# EAGLE design base (EAGLE 6.5.0)
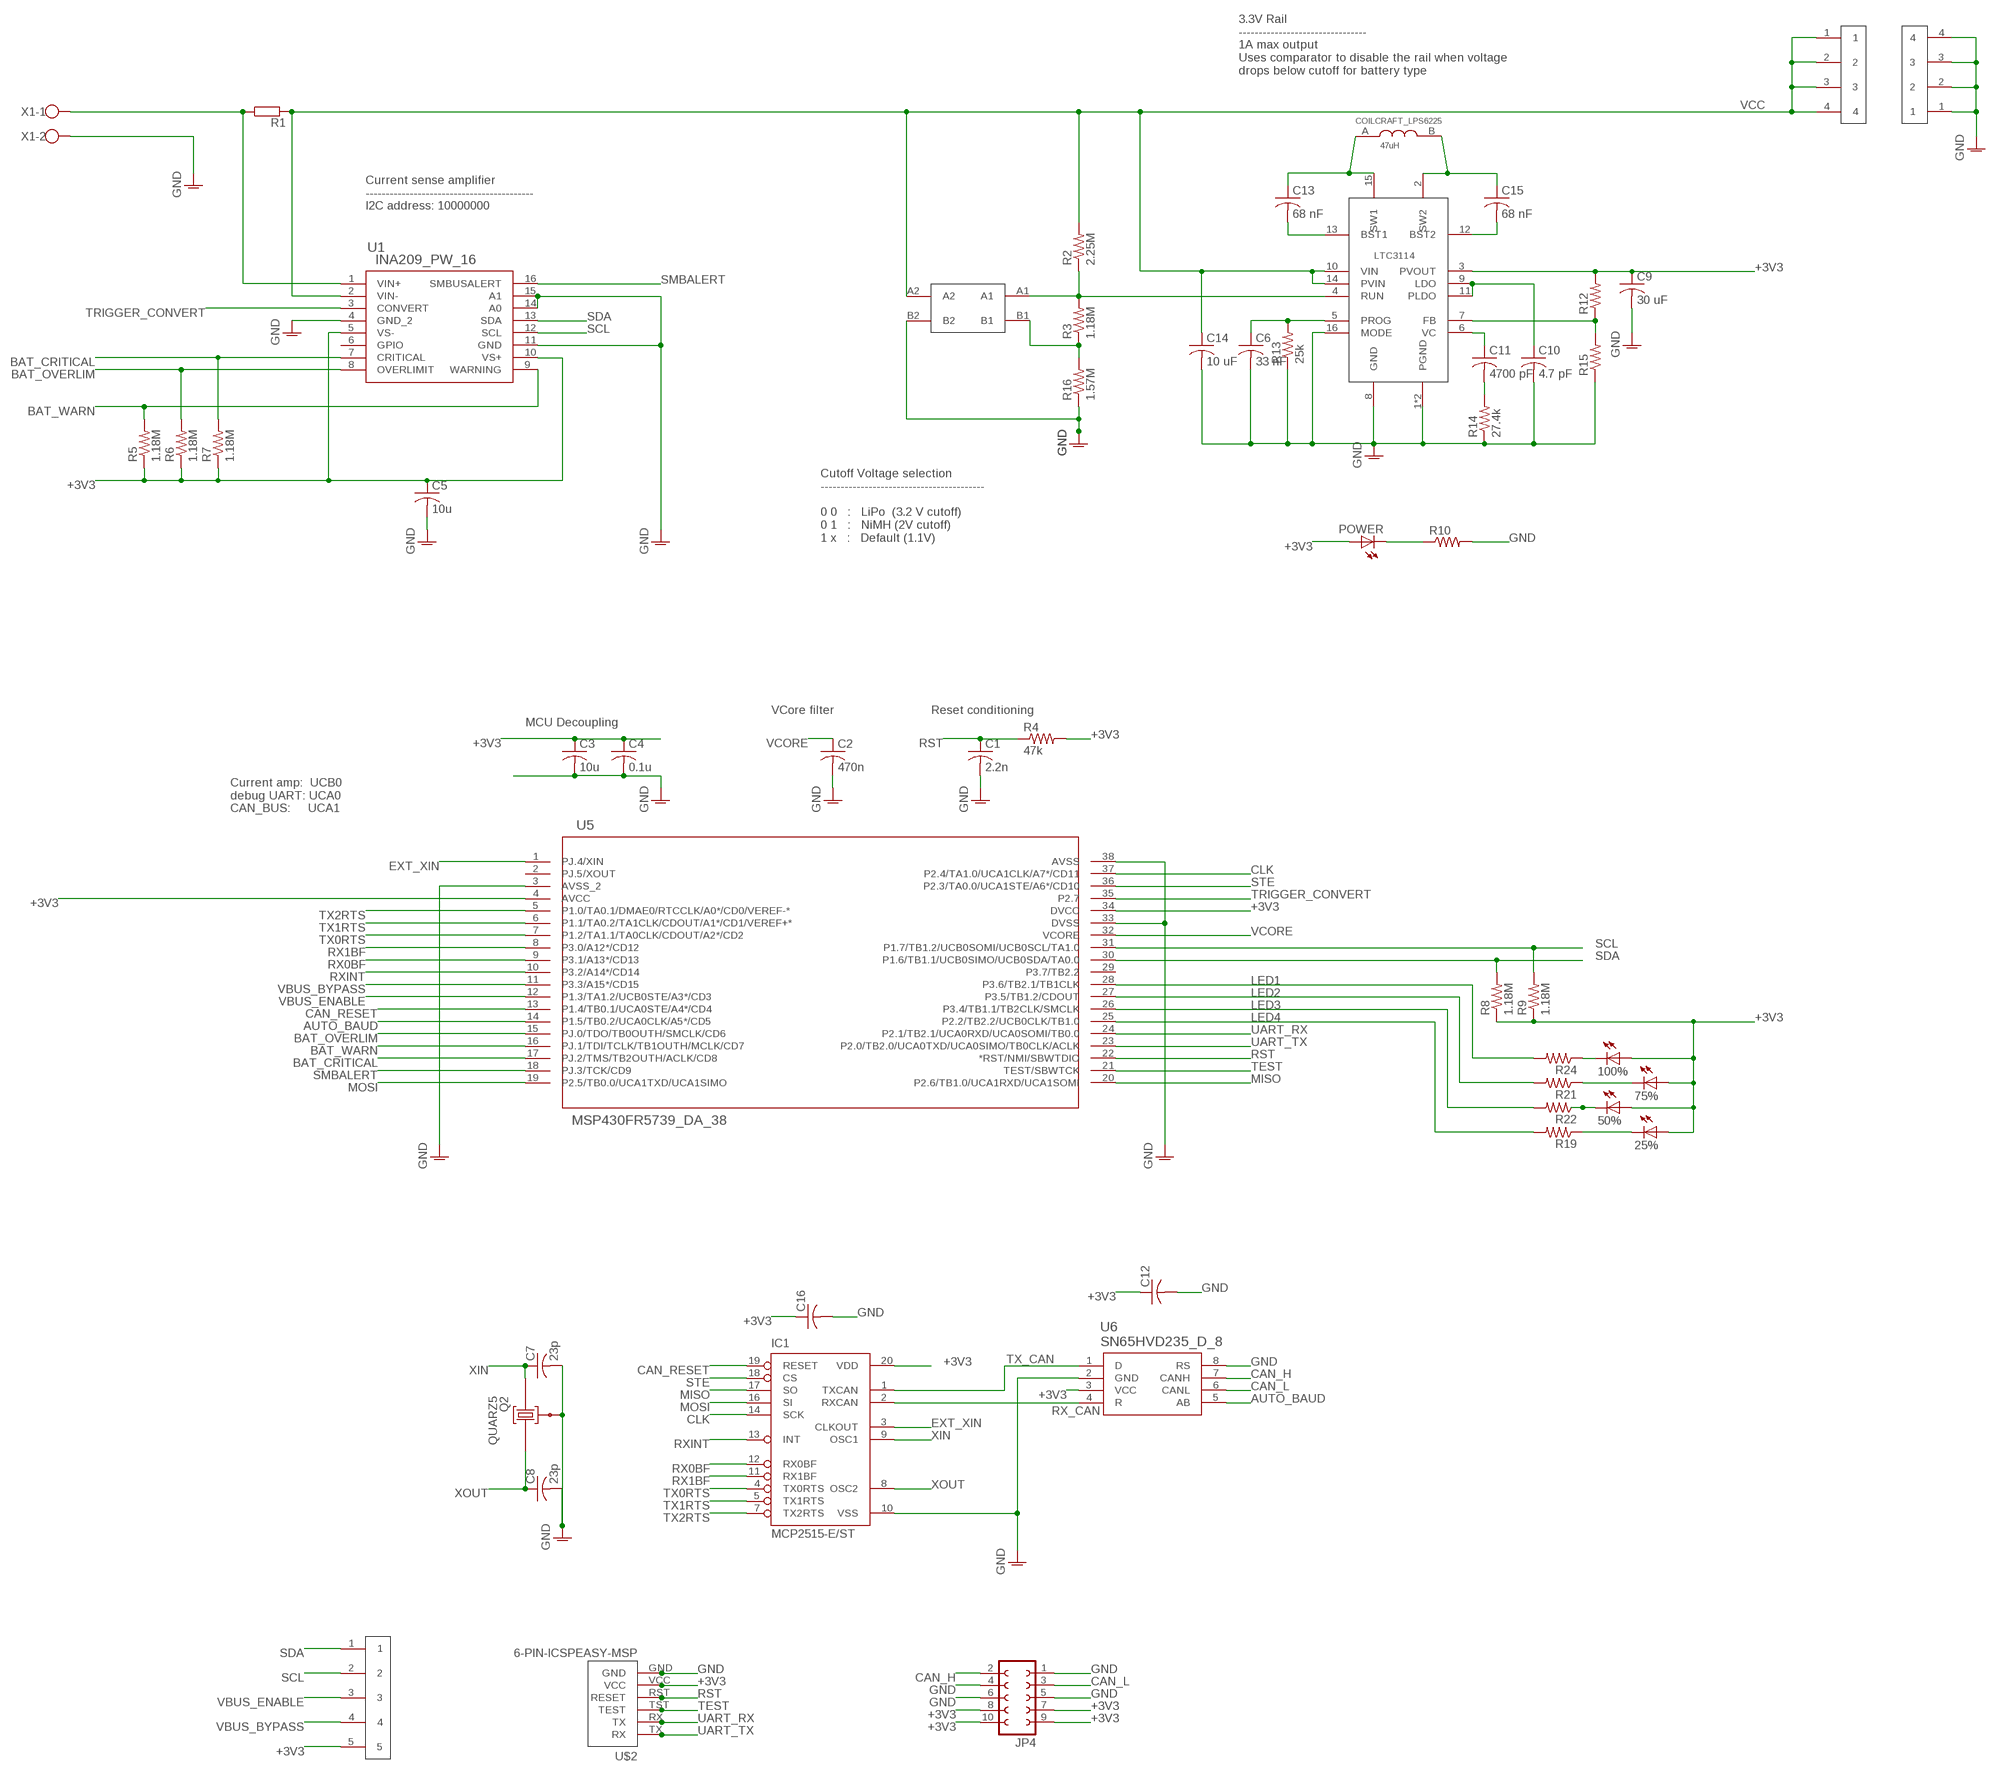
[diagram p0: schematic, sheet 1]

## Parts
25%  LEDCHIP-LED0603  [CHIP-LED0603]
50%  LEDCHIP-LED0603  [CHIP-LED0603]
75%  LEDCHIP-LED0603  [CHIP-LED0603]
100%  LEDCHIP-LED0603  [CHIP-LED0603]
C1  2.2n  C-USC1206  [C1206]
C2  470n  C-USC1206  [C1206]
C3  10u  C-USC1206  [C1206]
C4  0.1u  C-USC1206  [C1206]
C5  10u  C-USC1206  [C1206]
C6  33 nF  C-USC0805  [C0805]
C7  23p  C-USC1206  [C1206]
C8  23p  C-USC1206  [C1206]
C9  30 uF  C-USC0805  [C0805]
C10  4.7 pF  C-USC0805  [C0805]
C11  4700 pF  C-USC0805  [C0805]
C12  C-USC0603  [C0603]
C13  68 nF  C-USC0805  [C0805]
C14  10 uF  C-USC0805  [C0805]
C15  68 nF  C-USC0805  [C0805]
C16  C-USC0603  [C0603]
COILCRAFT_LPS6225  47uH  COILCRAFT_LPS6225  [INDUCTOR]
IC1  MCP2515-E/ST  [TSSOP20]
JP4  FE05-2  [FE05-2]
POWER  LEDCHIP-LED0603  [CHIP-LED0603]
Q2  QUARZ5  [QUARZ5]
R1  SMR  [SMR]
R2  2.25M  R-US_R0805  [R0805]
R3  1.18M  R-US_R0805  [R0805]
R4  47k  R-US_R1206  [R1206]
R5  1.18M  R-US_R0805  [R0805]
R6  1.18M  R-US_R0805  [R0805]
R7  1.18M  R-US_R0805  [R0805]
R8  1.18M  R-US_R0805  [R0805]
R9  1.18M  R-US_R0805  [R0805]
R10  R-US_R0603  [R0603]
R12  R-US_M0805  [M0805]
R13  25k  R-US_M0805  [M0805]
R14  27.4k  R-US_M0805  [M0805]
R15  R-US_M0805  [M0805]
R16  1.57M  R-US_R0805  [R0805]
R19  R-US_R0603  [R0603]
R21  R-US_R0603  [R0603]
R22  R-US_R0603  [R0603]
R24  R-US_R0603  [R0603]
U1  INA209_PW_16  [PW16]
U5  MSP430FR5739_DA_38  [DA38]
U6  SN65HVD235_D_8  [D8]
U$1  LTC3114  [TSSOP-16]
U$2  6-PIN-ICSPEASY-MSP  [EASYMSP-6PIN]
U$3  1X4_HEADER  [1X4-.1HEADER]
U$4  1X5_HEADER  [1X5-.1HEADER]
U$5  76SB02T  [DIP-4]
U$11  1X4_HEADER  [1X4-.1HEADER]
X1  W237-102  [W237-102]

## Nets
+3V3: 25%.A 50%.A 75%.A 100%.A C3.1 C4.1 C5.1 C9.1 C12.1 C16.1 IC1.20(VDD) JP4.7 JP4.8 JP4.9 JP4.10 POWER.A R4.2 R5.1 R6.1 R7.1 R8.1 R9.1 R12.2 U1.5(VS-) U1.10(VS+) U5.4(AVCC) U5.34(DVCC) U6.3(VCC) U$1.3(PVOUT) U$2.VCC U$4.5
AUTO_BAUD: U5.14(P1.5/TB0.2/UCA0CLK/A5*/CD5) U6.5(AB)
BAT_CRITICAL: R7.2 U1.7(CRITICAL) U5.17(PJ.2/TMS/TB2OUTH/ACLK/CD8)
BAT_OVERLIM: R6.2 U1.8(OVERLIMIT) U5.15(PJ.0/TDO/TB0OUTH/SMCLK/CD6)
BAT_WARN: R5.2 U1.9(WARNING) U5.16(PJ.1/TDI/TCLK/TB1OUTH/MCLK/CD7)
CAN_H: JP4.2 U6.7(CANH)
CAN_L: JP4.3 U6.6(CANL)
CAN_RESET: IC1.19(RESET) U5.13(P1.4/TB0.1/UCA0STE/A4*/CD4)
CLK: IC1.14(SCK) U5.37(P2.4/TA1.0/UCA1CLK/A7*/CD11)
EXT_XIN: IC1.3(CLKOUT) U5.1(PJ.4/XIN)
GND: C1.2 C2.2 C3.2 C4.2 C5.2 C6.2 C7.2 C8.2 C9.2 C10.2 C12.2 C14.2 C16.2 IC1.10(VSS) JP4.1 JP4.4 JP4.5 JP4.6 Q2.GND@0 R10.2 R13.1 R14.1 R15.1 R16.1 U1.4(GND_2) U1.11(GND) U1.14(A0) U1.15(A1) U5.3(AVSS_2) U5.33(DVSS) U5.38(AVSS) U6.2(GND) U6.8(RS) U$1.1(PGND) U$1.8(GND) U$1.16(MODE) U$1.PAD(PGND) U$2.GND U$3.1 U$3.2 U$3.3 U$3.4 U$5.B2 X1.2
LED1: R24.2 U5.28(P3.6/TB2.1/TB1CLK)
LED2: R21.2 U5.27(P3.5/TB1.2/CDOUT)
LED3: R22.2 U5.26(P3.4/TB1.1/TB2CLK/SMCLK)
LED4: R19.2 U5.25(P2.2/TB2.2/UCB0CLK/TB1.0)
MISO: IC1.17(SO) U5.20(P2.6/TB1.0/UCA1RXD/UCA1SOMI)
MOSI: IC1.16(SI) U5.19(P2.5/TB0.0/UCA1TXD/UCA1SIMO)
N$1: 25%.C R19.1
N$2: R3.1 R16.2 U$5.B1
N$5: POWER.C R10.1
N$6: C13.1 COILCRAFT_LPS6225.A U$1.15(SW1)
N$7: C15.1 COILCRAFT_LPS6225.B U$1.2(SW2)
N$8: C13.2 U$1.13(BST1)
N$9: C15.2 U$1.12(BST2)
N$11: C6.1 R13.2 U$1.5(PROG)
N$13: C10.1 U$1.9(LDO) U$1.11(PLDO)
N$15: C11.1 U$1.6(VC)
N$16: C11.2 R14.2
N$17: R12.1 R15.2 U$1.7(FB)
N$21: R2.1 R3.2 U$1.4(RUN) U$5.A1
N$33: 50%.C R22.1
N$34: 75%.C R21.1
N$35: 100%.C R24.1
RST: C1.1 R4.1 U5.22(*RST/NMI/SBWTDIO) U$2.RST(RESET)
RX0BF: IC1.12(RX0BF) U5.9(P3.1/A13*/CD13)
RX1BF: IC1.11(RX1BF) U5.8(P3.0/A12*/CD12)
RX_CAN: IC1.2(RXCAN) U6.4(R)
RXINT: IC1.13(INT) U5.10(P3.2/A14*/CD14)
SCL: R9.2 U1.12(SCL) U5.31(P1.7/TB1.2/UCB0SOMI/UCB0SCL/TA1.0) U$4.2
SDA: R8.2 U1.13(SDA) U5.30(P1.6/TB1.1/UCB0SIMO/UCB0SDA/TA0.0) U$4.1
SMBALERT: U1.16(SMBUSALERT) U5.18(PJ.3/TCK/CD9)
STE: IC1.18(CS) U5.36(P2.3/TA0.0/UCA1STE/A6*/CD10)
TEST: U5.21(TEST/SBWTCK) U$2.TST(TEST)
TRIGGER_CONVERT: U1.3(CONVERT) U5.35(P2.7)
TX0RTS: IC1.4(TX0RTS) U5.7(P1.2/TA1.1/TA0CLK/CDOUT/A2*/CD2)
TX1RTS: IC1.5(TX1RTS) U5.6(P1.1/TA0.2/TA1CLK/CDOUT/A1*/CD1/VEREF+*)
TX2RTS: IC1.7(TX2RTS) U5.5(P1.0/TA0.1/DMAE0/RTCCLK/A0*/CD0/VEREF-*)
TX_CAN: IC1.1(TXCAN) U6.1(D)
UART_RX: U5.24(P2.1/TB2.1/UCA0RXD/UCA0SOMI/TB0.0) U$2.RX(TX)
UART_TX: U5.23(P2.0/TB2.0/UCA0TXD/UCA0SIMO/TB0CLK/ACLK) U$2.TX(RX)
VBUS_BYPASS: U5.11(P3.3/A15*/CD15) U$4.4
VBUS_ENABLE: U5.12(P1.3/TA1.2/UCB0STE/A3*/CD3) U$4.3
VCC: C14.1 R1.2 R2.2 U1.2(VIN-) U$1.10(VIN) U$1.14(PVIN) U$5.A2 U$11.1 U$11.2 U$11.3 U$11.4
VCC_1: R1.1 U1.1(VIN+) X1.1
VCORE: C2.1 U5.32(VCORE)
XIN: C7.1 IC1.9(OSC1) Q2.2
XOUT: C8.1 IC1.8(OSC2) Q2.1
Unconnected: U1.6(GPIO) U5.2(PJ.5/XOUT) U5.29(P3.7/TB2.2)

## Notes on the sheet
- 3.3V Rail
  --------------------------------
  1A max output
  Uses comparator to disable the rail when voltage
  drops below cutoff for battery type
- Current sense amplifier
  ------------------------------------------
  I2C address: 10000000
- Cutoff Voltage selection
  -----------------------------------------
  
  0 0   :   LiPo  (3.2 V cutoff)
  0 1   :   NiMH (2V cutoff)
  1 x   :   Default (1.1V)
- VCore filter | Reset conditioning
- MCU Decoupling
- Current amp:  UCB0
  debug UART: UCA0
  CAN_BUS:     UCA1

## Library data of the parts
25% 50% 75% 100% POWER = adafruit:LED: LED OSRAM: - CHIPLED LG R971, LG N971, LY N971, LG Q971, LY Q971, LO R971, LY R971 LH N974, LH R974 LS Q976, LO Q976, LY Q976 LO Q996 - Hyper CHIPLED LW Q18S LB Q993, LB Q99A, LB R99A - SideLED LS A670, LO A670, LY A670, LG A670, LP A670 LB A673, LV A673, LT A673, LW A673 LH A674 LY A675 LS A676, LA A676, LO A676, LY A676, LW A676 LS A679, LY A679, LG A679 - Hyper Micro SIDELED® LS Y876, LA Y876, LO Y876, LY Y876 LT Y87S - SmartLED LW L88C, LW L88S LB L89C, LB L89S, LG L890 LS L89K, LO L89K, LY L89K LS L896, LA L896, LO L896, LY L896 - TOPLED LS T670, LO T670, LY T670, LG T670, LP T670 LSG T670, LSP T670, LSY T670, LOP T670, LYG T670 LG T671, LOG T671, LSG T671 LB T673, LV T673, LT T673, LW T673 LH T674 LS T676, LA T676, LO T676, LY T676, LB T676, LH T676, LSB T676, LW T676 LB T67C, LV T67C, LT T67C, LS T67K, LO T67K, LY T67K, LW E67C LS E67B, LA E67B, LO E67B, LY E67B, LB E67C, LV E67C, LT E67C LW T67C LS T679, LY T679, LG T679 LS T770, LO T770, LY T770, LG T770, LP T770 LB T773, LV T773, LT T773, LW T773 LH T774 LS E675, LA E675, LY E675, LS T675 LS T776, LA T776, LO T776, LY T776, LB T776 LHGB T686 LT T68C, LB T68C - Hyper Mini TOPLED® LB M676 - Mini TOPLED Santana® LG M470 LS M47K, LO M47K, LY M47K Source: http://www.osram.convergy.de/
C1-C16 = adafruit:C-US: CAPACITOR, American symbol
COILCRAFT_LPS6225 = misc_passives:COILCRAFT_LPS6225
IC1 = mcp2515:MCP2515
JP4 = con-lsta:FE05-2: FEMALE HEADER; OC_FARNELL: unknown; OC_NEWARK: unknown
Q2 = sMSP430:QUARZ5
R1 = resistor-shunt:SMR: SMD SHUNT RESISTOR; OC_FARNELL: unknown; OC_NEWARK: unknown
R2-R10 R12-R16 R19 R21 R22 R24 = adafruit:R-US_: RESISTOR, American symbol
U1 = TexasInstruments:INA209_PW_16; DATASHEETURL: http://www.ti.com/lit/gpn/INA209; DESCRIPTION: High-Side Measurement, Bi-Directional Current/Power Monitor with I2C Interface; FAMILY_NAME: CURRENT SHUNT MONITOR; GENERIC_PART_NUMBER: INA209; INDUSTRY_STD_PKG_TYPE: TSSOP; MANUFACTURER: Texas Instruments; MANUFACTURER_PART_NUMBER: ina209_pw_16; PACKAGE_DESIGNATOR: PW; PIN_COUNT: 16; VENDOR: Texas Instruments
U5 = TexasInstruments:MSP430FR5739_DA_38; DATASHEETURL: http://www.ti.com/lit/gpn/MSP430FR5739; DESCRIPTION: MSP430FR573x,MSP430FR572x Mixed Signal Microcontroller; FAMILY_NAME: FRAM Series; GENERIC_PART_NUMBER: MSP430FR5739; INDUSTRY_STD_PKG_TYPE: TSSOP; MANUFACTURER: Texas Instruments; MANUFACTURER_PART_NUMBER: msp430fr5739_da_38; PACKAGE_DESIGNATOR: DA; PIN_COUNT: 38; VENDOR: Texas Instruments
U6 = TexasInstruments:SN65HVD235_D_8; DATASHEETURL: http://www.ti.com/lit/gpn/SN65HVD235; DESCRIPTION: 3.3V CAN with Standby Mode, Autobaud Loop-back; FAMILY_NAME: CAN; GENERIC_PART_NUMBER: SN65HVD235; INDUSTRY_STD_PKG_TYPE: SOIC; MANUFACTURER: Texas Instruments; MANUFACTURER_PART_NUMBER: sn65hvd235_d_8; PACKAGE_DESIGNATOR: D; PIN_COUNT: 8; VENDOR: Texas Instruments
U$1 = linear:LTC3114
U$2 = LaunchFET:6-PIN-ICSP: 6 pin easy-msp formatted headers. Designed to make programming target boards with MSP430 Launchpad easier. EASYMSP: standard .05" pitch header to match launchpad SAFEMSP: .05" header with .025" offset Vcc to keep Geordi away
U$3 U$11 = connectors:1X4_HEADER
U$4 = connectors:1X5_HEADER
U$5 = misc_passives:76SB02T
X1 = con-wago-500:W237-102: WAGO SCREW CLAMP; MPN: 237-102; OC_FARNELL: unknown; OC_NEWARK: 70K9898

## Board
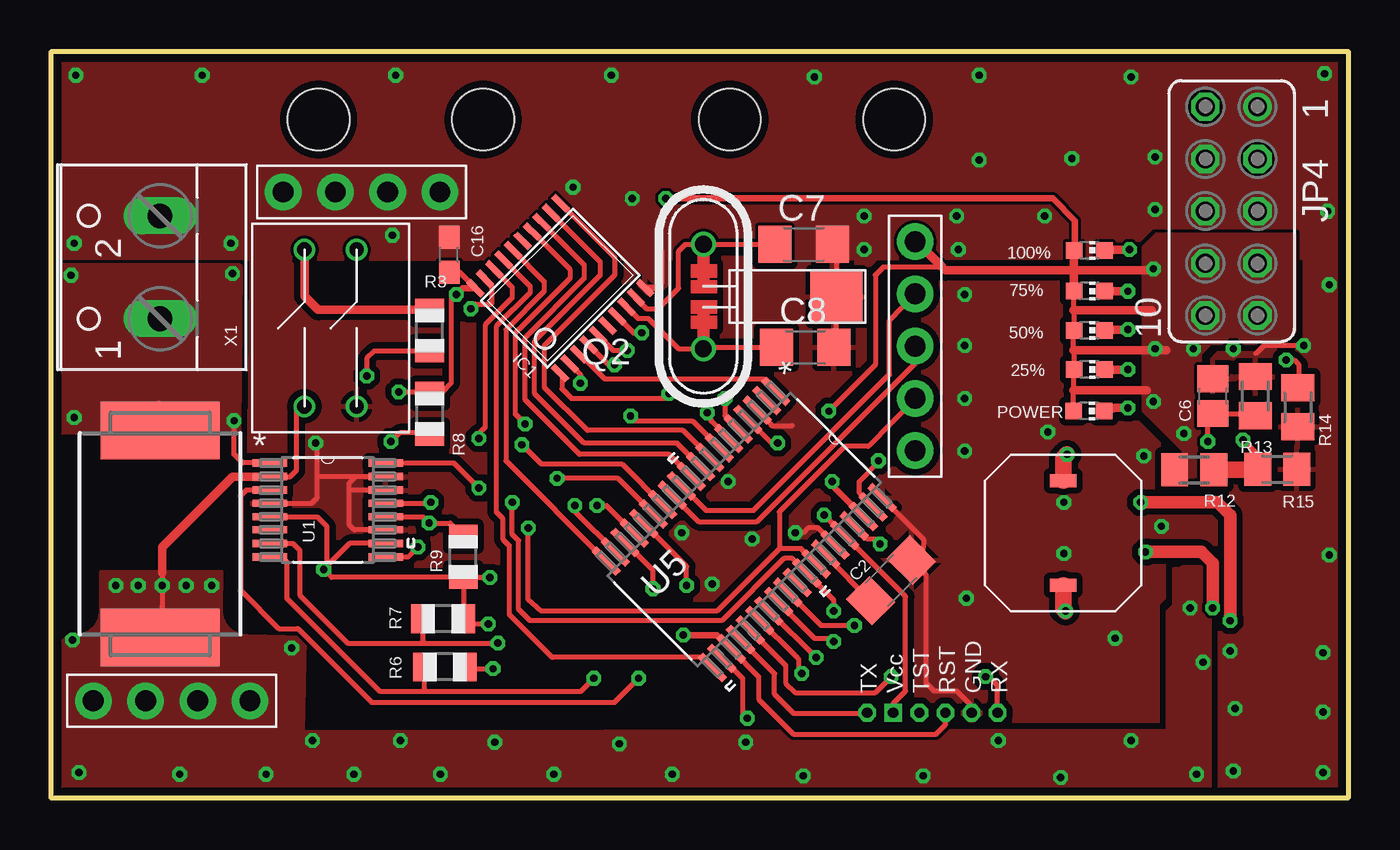
[diagram p1: board, top side]
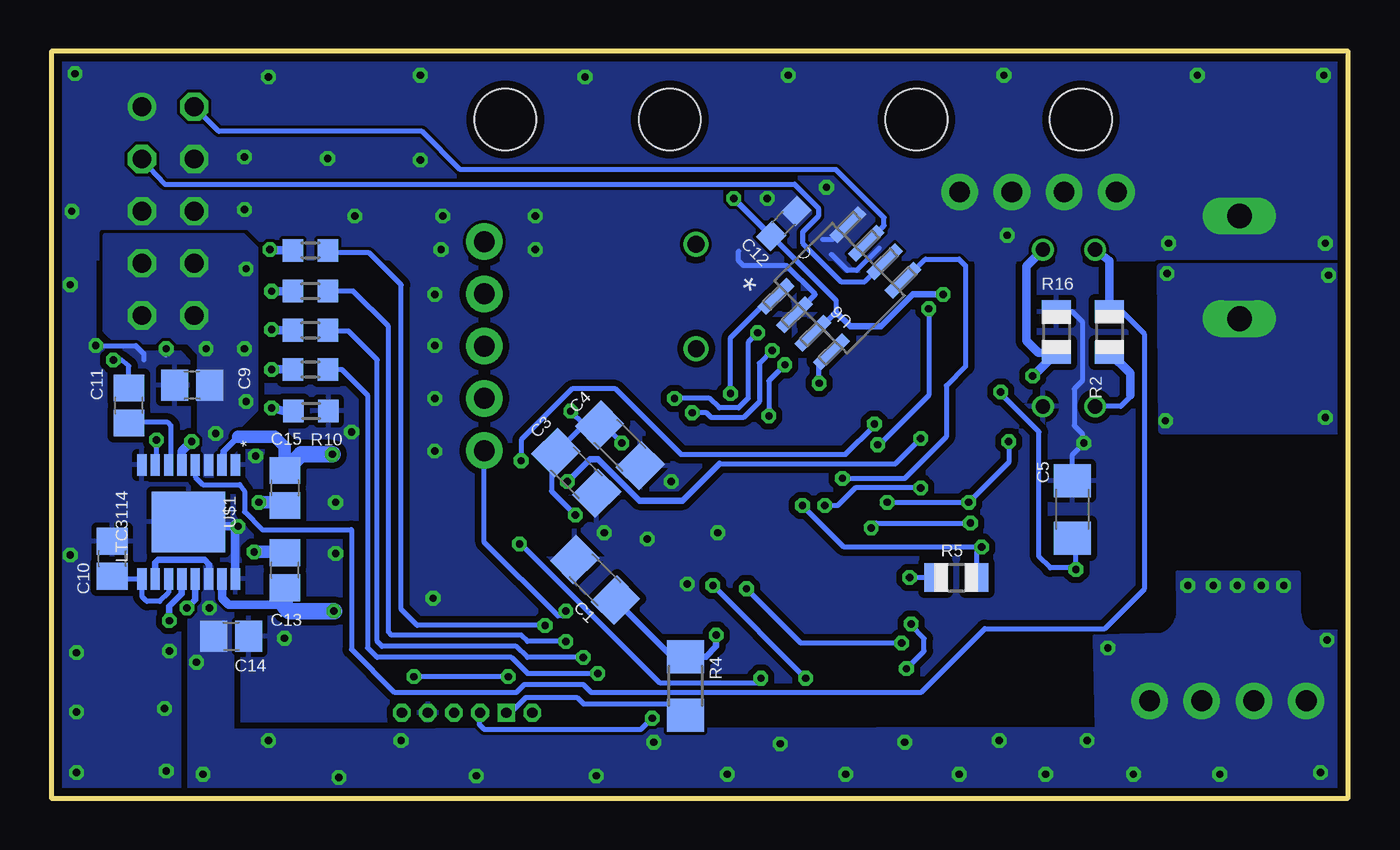
[diagram p2: board, bottom side, seen from below]

Size 63.09 x 36.32 mm. Coordinates in mm from the lower left corner, seen from the top.
Outline: 0,36.32 63.09,36.32 63.09,0 0,0 0,36.32
Copper layers (1*16): Top 0.0356mm / dielectric 1.5011mm / Bottom 0.0356mm
Design rules "oshpark *": minimum track width 6mil, minimum drill 13mil, track to track 6mil, track to pad 6mil, pad to pad 6mil, via to via 6mil, smd to smd 6mil, copper to edge 15mil, drill to drill 6mil, minimum pad ring 7mil, minimum via ring 7mil, stop-mask expansion 20mil, vias tented up to drill 0mil, thermal gap 10mil
Holes 3 mm at 13,33 33,33 21,33 41,33

### Footprints (pad centres in the part's own frame; a part is rotated, then mirrored left to right if it is on the bottom)
CHIP-LED0603 = smd 0.8 x 0.8: A 0,-0.75; C 0,0.75
C1206 = smd 1.6 x 1.8: 1 -1.4,0; 2 1.4,0
C0805 = smd 1.3 x 1.5: 1 -0.85,0; 2 0.85,0
C0603 = smd 1.1 x 1: 1 -0.85,0; 2 0.85,0
INDUCTOR = smd 0.635 x 1.27: A -2.54,0; B 2.54,0
TSSOP20 = smd 0.305 x 0.991: 1 -2.925,-2.918; 2 -2.275,-2.918; 3 -1.625,-2.918; 4 -0.975,-2.918; 5 -0.325,-2.918; 6 0.325,-2.918; 7 0.975,-2.918; 8 1.625,-2.918; 9 2.275,-2.918; 10 2.925,-2.918; 11 2.925,2.918; 12 2.275,2.918; 13 1.625,2.918; 14 0.975,2.918; 15 0.325,2.918; 16 -0.325,2.918; 17 -0.975,2.918; 18 -1.625,2.918; 19 -2.275,2.918; 20 -2.925,2.918
FE05-2 = drill 0.914: 1 -5.08,1.27 | drill 0.914 octagon: 2 -5.08,-1.27; 3 -2.54,1.27; 4 -2.54,-1.27; 5 0,1.27; 6 0,-1.27; 7 2.54,1.27; 8 2.54,-1.27; 9 5.08,1.27; 10 5.08,-1.27
QUARZ5 = drill 0.813: 1 1.53,1.773; 2 1.52,-3.303 | smd 2.54 x 2.54: GND@0 -4.941,-0.762
SMR = smd 2.8 x 5.8: 1 5.029,0; 2 -5.029,0
R0805 = smd 1.1 x 1.4: 1 -1,0; 2 1,0
R1206 = smd 1.6 x 1.803: 1 -1.422,0; 2 1.422,0
R0603 = smd 1 x 1.1: 1 -0.85,0; 2 0.85,0
M0805 = smd 1.3 x 1.6: 1 -0.95,0; 2 0.95,0
PW16 = smd 1.676 x 0.356: 1 -2.819,2.286; 2 -2.819,1.626; 3 -2.819,0.965; 4 -2.819,0.33; 5 -2.819,-0.33; 6 -2.819,-0.965; 7 -2.819,-1.626; 8 -2.819,-2.286; 9 2.819,-2.286; 10 2.819,-1.626; 11 2.819,-0.965; 12 2.819,-0.33; 13 2.819,0.33; 14 2.819,0.965; 15 2.819,1.626; 16 2.819,2.286
DA38 = smd 1.676 x 0.356: 1 -3.658,5.842; 2 -3.658,5.207; 3 -3.658,4.547; 4 -3.658,3.912; 5 -3.658,3.251; 6 -3.658,2.591; 7 -3.658,1.956; 8 -3.658,1.295; 9 -3.658,0.66; 10 -3.658,0; 11 -3.658,-0.66; 12 -3.658,-1.295; 13 -3.658,-1.956; 14 -3.658,-2.591; 15 -3.658,-3.251; 16 -3.658,-3.912; 17 -3.658,-4.547; 18 -3.658,-5.207; 19 -3.658,-5.842; 20 3.658,-5.842; 21 3.658,-5.207; 22 3.658,-4.547; 23 3.658,-3.912; 24 3.658,-3.251; 25 3.658,-2.591; 26 3.658,-1.956; 27 3.658,-1.295; 28 3.658,-0.66; 29 3.658,0; 30 3.658,0.66; 31 3.658,1.295; 32 3.658,1.956; 33 3.658,2.591; 34 3.658,3.251; 35 3.658,3.912; 36 3.658,4.547; 37 3.658,5.207; 38 3.658,5.842
D8 = smd 1.981 x 0.559: 1 -2.464,1.905; 2 -2.464,0.635; 3 -2.464,-0.635; 4 -2.464,-1.905; 5 2.464,-1.905; 6 2.464,-0.635; 7 2.464,0.635; 8 2.464,1.905
TSSOP-16 = smd 0.45 x 1.05: 1 0,0.525; 2 0.65,0.525; 3 1.3,0.525; 4 1.95,0.525; 5 2.6,0.525; 6 3.25,0.525; 7 3.9,0.525; 8 4.55,0.525; 9 4.55,6.075; 10 3.9,6.075; 11 3.25,6.075; 12 2.6,6.075; 13 1.95,6.075; 14 1.3,6.075; 15 0.65,6.075; 16 0,6.075 | smd 3.58 x 2.94: PAD 2.275,3.3
EASYMSP-6PIN = drill 0.5 octagon: GND 0,-1.27; RST 0,0; RX 0,-2.54; TST 0,1.27; TX 0,3.81 | drill 0.5 square: VCC 0,2.54
1X4-.1HEADER = drill 1.016 pad 1.778: 1 -5.08,0; 2 -2.54,0; 3 0,0; 4 2.54,0
1X5-.1HEADER = drill 1.016 pad 1.778: 1 -2.54,0; 2 0,0; 3 2.54,0; 4 5.08,0; 5 7.62,0
DIP-4 = drill 0.7: A1 0,7.62; A2 0,0; B1 2.54,7.62; B2 2.54,0
W237-102 = drill 1.194 long: 1 -2.5,-1.27; 2 2.5,-1.27

### Placement (x,y rotation side)
25%  50.5,20.85 270 top
50%  50.5,22.75 270 top
75%  50.5,24.66 270 top
100%  50.5,26.64 270 top
C1  36.64,10.62 135 bottom
C2  40.85,10.59 45 top
C3  37.55,15.82 315 bottom
C4  35.43,17.16 315 bottom
C5  13.41,14.04 90 bottom
C6  56.51,19.55 90 top
C7  36.6,26.93 0 top
C8  36.68,21.93 0 top
C9  56.24,20.08 180 bottom
C10  60.13,11.64 90 bottom
C11  59.32,19.1 90 bottom
C12  27.46,27.95 45 bottom
C13  51.73,11.08 90 bottom
C14  54.34,7.87 0 bottom
C15  51.73,15.09 270 bottom
C16  19.35,26.43 90 top
COILCRAFT_LPS6225  49.23,12.9 90 top
IC1  24.76,24.81 45 top
JP4  57.41,28.55 270 top
POWER  50.48,18.83 270 top
Q2  33.25,23.63 180 top
R1  5.29,12.85 90 top
R2  11.61,22.67 270 bottom
R3  18.41,22.74 90 top
R4  32.23,5.46 270 bottom
R5  19.06,10.73 0 bottom
R6  19.14,6.38 180 top
R7  19.06,8.73 180 top
R8  18.4,18.69 270 top
R9  20.04,11.74 90 top
R10  50.46,18.83 0 bottom
R12  55.6,15.97 180 top
R13  58.58,19.55 270 top
R14  60.64,19.01 90 top
R15  59.65,16 180 top
R16  14.2,22.67 270 bottom
R19  50.49,20.85 0 bottom
R21  50.49,24.66 0 bottom
R22  50.49,22.75 0 bottom
R24  50.49,26.64 0 bottom
U1  13.45,14.01 0 top
U5  33.71,13.07 315 top
U6  24.74,24.8 45 bottom
U$1  54.14,16.73 180 bottom
U$2  43.5,4.15 90 top
U$3  16.36,29.48 0 top
U$4  42.03,19.44 90 top
U$5  12.31,19.05 0 top
U$11  7.12,4.73 0 top
X1  4.02,25.82 90 top

### Tracks (layer width: path | path; a pad name or v marks a point on that pad's centre or on a via)
+3V3  (via drill 0.36)
  Top 0.254: IC1.20 19.85,25.58 C16.1 | U1.10 14.51,12.39 13.4,11.27 | U1.5 12.94,13.68 13.4,13.22 13.4,11.27 | 13.4,11.27 v13.25,11.12 13.63,10.74 R9.1 | v19.7,24.5 19.47,24.27 19.47,20.22 18.92,19.68 18.42,19.68 R8.1 18.34,19.75 v16.9,19.75 | U$2.VCC 40.96,4.61 41.56,5.21 41.56,9.81 U5.34 37.83,13.55 v37.59,13.76 | U5.4 35.04,17.26 v35.34,17.26 | 43.51,25.67 43.35,25.82 40.47,25.82 40.08,25.43 40.08,21.08 v37.83,18.82 | R9.1 20.06,10.72 R7.1 20.31,8.47 v21.26,8.47 | R6.1 20.22,6.3 v21.49,6.3 | R9.1 v21.34,10.73 | 49.75,18.86 49.73,18.88 49.73,19.83 49.73,20.84 | 25%.A 49.75,21.75 49.73,21.78 49.73,22.79 | 75%.A 49.73,24.64 49.73,23.72 49.75,23.7 50%.A
  Top 0.305: IC1.20 20,24.8 v19.7,24.5 | v29.89,29.17 48.72,29.17 49.81,28.08 49.81,26.7 100%.A | 49.73,25.67 49.96,25.67
  Top 0.406: 49.75,18.86 POWER.A | 49.73,21.78 54.24,21.78 | 100%.A 75%.A | 53.54,25.67 49.96,25.67 43.51,25.67 | 49.73,23.72 53.54,23.72 | 49.73,19.83 53.31,19.83 | 43.35,25.82 42.11,27.06 U$4.5
  Bottom 0.254: C12.1 24.91,24.2 24.91,23.64 25.95,22.61 U6.3 | C5.1 13.25,12.48 v13.25,11.12 13.32,11.2 14.49,11.2 15.04,11.74 15.04,17.81 16.9,19.68 v16.9,19.75 | U$2.VCC 40.75,4.15 40.01,4.9 37.52,4.9 37.2,4.58 32.78,4.58 R4.2 | 37.2,18.15 C4.1 36.22,18.15 v35.34,17.26 | 37.2,18.15 C3.1 38.76,16.59 38.76,14.93 v37.59,13.76 | v37.83,18.82 37.2,18.2 37.2,18.15 | v21.49,6.3 20.64,7.15 20.64,7.77 21.26,8.4 v21.26,8.47 | v21.34,10.73 21.18,10.73 R5.1
  Bottom 0.305: C12.1 28.15,27.35 28.15,27.43 v29.89,29.17 | v19.7,24.5 21.18,24.5 22.74,22.94 24.21,22.94 24.91,23.64
  other vias: 55.1,17.73 53.62,19.29 53.7,21.85 53.62,25.74 55.56,21.85
  pour Bottom (no thermals): 55.87,15.71 55.87,21.62 56.42,22.17 59.92,22.17 60.46,22.71 60.46,27.38 53.77,27.38 53.15,26.75 53.15,18.9 55.1,16.95 55.1,15.63
  pour Top (no thermals): 55.87,15.71 55.87,21.62 56.42,22.17 59.92,22.17 60.46,22.71 60.46,27.38 54.32,27.38 53.77,27.38 53.15,26.75 53.15,18.9 55.1,16.95 55.1,15.63
AUTO_BAUD  (via drill 0.36)
  Top 0.254: U5.14 27.56,15.55 v24.6,15.55
  Bottom 0.254: U6.5 21.57,25.19 20.56,26.21 18.92,26.21 18.61,25.9 18.61,21 19.55,20.06 19.55,17.58 21.57,15.55 v24.6,15.55
BAT_CRITICAL  (via drill 0.36)
  Top 0.254: U1.7 11.74,12.39 12.08,12.05 12.08,9.87 14.41,7.54 18.15,7.54 | R7.2 18.06,7.63 18.15,7.54 | 18.15,7.54 v21.72,7.54 | v29.27,10.19 29.27,11.07 U5.17
  Bottom 0.254: v21.72,7.54 26.63,7.54 v29.27,10.19
BAT_OVERLIM  (via drill 0.36)
  Top 0.254: U1.8 11.24,11.73 11.46,11.51 11.46,9.72 15.97,5.21 18.15,5.21 | R6.2 18.14,5.22 18.15,5.21 | 18.15,5.21 25.77,5.21 v26.39,5.83 | v30.9,10.34 30.9,11.27 U5.15
  Bottom 0.254: v26.39,5.83 v30.9,10.34
BAT_WARN  (via drill 0.36)
  Top 0.254: U1.9 17.35,11.73 v17.84,12.21 | v26.55,14.23 27.01,14.23 U5.16
  Bottom 0.254: R5.2 18.06,11.98 v17.84,12.21 24.53,12.21 v26.55,14.23
CAN_H
  Bottom 0.254: U6.7 22.58,27.84 22.58,28.23 24.91,30.57 43.19,30.57 45.06,32.43 54.95,32.43 JP4.2
CAN_L
  Bottom 0.254: U6.6 23.52,25.12 24.68,25.12 26.55,26.99 26.55,27.53 25.77,28.31 25.77,28.7 26.94,29.87 57.59,29.87 58.69,31.04 JP4.3
CAN_RESET  (via drill 0.36)
  Top 0.254: IC1.19 21.41,24.93 21.41,24.03 20.64,24.03 v20.4,23.8 | v22.89,17.19 23.83,16.25 27.76,16.25 U5.13
  Bottom 0.254: v20.4,23.8 20.4,19.6 22.81,17.19 v22.89,17.19
CLK  (via drill 0.36)
  Top 0.254: IC1.14 25.23,25.72 25.23,25.28 22.58,22.63 22.58,18.66 v23.05,18.2 | U5.37 39.98,14.18 39.3,14.85 39.3,15.4 40.24,16.33 v40.24,16.41
  Bottom 0.254: v23.05,18.2 23.05,18.12 24.45,16.72 32.46,16.72 35.65,19.91 37.75,19.91 40.24,17.42 v40.24,16.41
EXT_XIN
  Top 0.254: U5.1 34.66,20.38 26.94,20.38 25.72,21.59 IC1.3
GND  (via drill 0.36)
  Top 0.254: C8.2 38.19,22.04 Q2.GND@0 38.19,26.74 C7.2 | U1.4 12.66,14.34 12.94,14.62 12.94,15.63 | 12.94,15.63 12.94,17.19 v12.86,17.26 | U1.15 14.8,15.64 | 14.8,15.64 12.94,15.64 12.94,15.63 | U1.11 14.74,13.05 14.49,13.3 14.49,15.01 | 14.49,15.01 14.49,15.33 14.8,15.64 | U1.14 14.52,14.98 14.49,15.01 | U5.38 40.42,14.59 42.42,12.6 42.42,12.15 C2.2 42.57,10.85 42.57,5.6 42.96,5.21 44.05,5.21 44.77,4.49 U$2.GND | 36.04,18.12 35.03,18.12 35.03,18.18 U5.3 | U5.33 37.3,13.14 36.82,13.14 36.58,12.91 v36.19,12.91 | v60.93,22.01 58.99,22.01 58.6,21.62 | v57.51,21.85 57.51,21.54
  Top 0.305: IC1.10 29.43,24.81 29.66,25.04 29.66,26.6
  Bottom 0.254: U6.8 25.07,27.16 25.57,27.16 | 26.86,28.45 C12.2 | C5.2 13.41,16.71 v12.86,17.26 12.94,17.34 12.94,17.73 13.32,18.12 13.32,19.91 12.94,20.3 12.94,23.18 13.43,23.67 R16.1 | 22.81,26.75 23.9,25.67 24.37,25.67 25.15,26.44 | U6.2 26.92,23.51 25.93,24.5 27.33,25.9 29.43,25.9 29.66,26.13 29.66,26.6 | v60.93,22.01 58.99,22.01 58.6,21.62 58.6,21.31 | v57.51,21.85 57.51,21.54
  Bottom 0.406: 54.14,13.35 v54.01,13.22 56.28,13.22 U$1.PAD | U$1.16 54.14,13.09
  other vias: 16.59,27.38 53.15,16.64 49.26,14.39 49.26,11.9 28.26,29.17 25.38,29.71 51.75,7.77 48.48,17.81 48.33,28.31 44.05,28.31 39.54,28.31 44.13,26.68 39.54,26.68 32.93,15.4 34.09,12.6 32.15,10.42 30.67,12.91 44.44,24.5 44.44,22.01 44.44,19.44 44.44,16.88 44.52,9.72 1.11,26.99 8.73,26.99 1.19,35.16 7.33,35.16 16.75,35.16 27.25,35.16 37.13,35.08 45.14,35.16 52.53,35.08 61.94,35.23 53.7,31.19 45.14,31.03 49.65,31.11 53.7,28.62 62.1,28.54 62.17,24.97 57.51,1.32 61.86,1.24 57.35,7.15 57.58,4.35 61.86,4.2 61.86,7.07 62.17,11.82
  pour Top (rank 2, no thermals): 0.02,36.24 62.56,36.32 62.49,26.29 -0.06,26.21
  pour Bottom (rank 2, no thermals): 0.02,36.24 62.56,36.32 62.49,26.29 -0.06,26.21
  pour Bottom (isolate 0.305, rank 4): 62.87,-0.32 63.03,26.37 0.02,26.21 -0.06,0
  pour Top (isolate 0.305, rank 4): 9.59,26.21 9.67,0 62.64,0 63.03,26.37
LED1  (via drill 0.36)
  Top 0.254: U5.28 37.44,8.4 v39.07,8.4
  Bottom 0.254: v39.07,8.4 45.29,8.4 46.07,9.17 46.07,24.97 47.63,26.52 49.52,26.52 R24.2
LED2  (via drill 0.36)
  Top 0.254: U5.27 35.38,9.52 37.13,7.77 37.9,7.77 v38.06,7.62
  Bottom 0.254: v38.06,7.62 39.93,7.62 40.24,7.93 46.54,7.93 46.69,8.09 46.69,22.94 48.41,24.65 R21.2
LED3  (via drill 0.36)
  Top 0.254: U5.26 34.95,9.1 v37.2,6.84
  Bottom 0.254: v37.2,6.84 39.93,6.84 40.47,7.39 47.01,7.39 47.24,7.62 47.24,21.31 48.64,22.71 49.59,22.71 R22.2
LED4  (via drill 0.36)
  Top 0.254: U5.25 36.19,6.92 36.2,6.92 36.35,6.76 36.35,6.22 v36.5,6.06
  Bottom 0.254: R19.2 48.96,20.85 47.71,19.6 47.71,7.31 47.24,6.84 40.71,6.84 39.93,6.06 v36.5,6.06
MISO
  Top 0.254: IC1.17 23.28,24.91 23.28,24.58 21.65,22.94 21.65,13.92 21.96,13.61 21.96,12.6 22.27,12.29 22.27,8.94 24.37,6.84 31.68,6.84 32.16,6.36 U5.20
MOSI
  Top 0.254: IC1.16 23.98,25.13 23.98,24.65 22.11,22.79 22.11,16.4 U5.19
N$1  (via drill 0.36)
  Top 0.406: v52.37,20.84 25%.C
  Bottom 0.406: R19.1 v52.37,20.85 v52.37,20.84
N$2  (via drill 0.36)
  Top 0.254: R3.1 15.7,21.74 15.35,21.39 v15.35,20.53
  Bottom 0.406: v15.35,20.53 15.35,20.52 R16.2 15.08,21.67 15.66,22.24 15.66,25.87 U$5.B1
N$5  (via drill 0.36)
  Top 0.406: v52.37,18.98 51.76,18.98 POWER.C
  Bottom 0.406: R10.1 51.84,18.83 v52.37,18.98
N$6  (via drill 0.36)
  Top 0.813: COILCRAFT_LPS6225.A 49.23,9.21 v49.34,9.1
  Bottom 0.254: 51.75,10.21 C13.1
  Bottom 0.406: U$1.15 54.79,9.72 54.47,9.41 51.83,9.41
  Bottom 0.61: 51.83,9.41 51.75,9.33
  Bottom 0.813: v49.34,9.1 51.52,9.1 51.75,9.33 51.75,10.21
N$7  (via drill 0.36)
  Top 0.813: COILCRAFT_LPS6225.B 49.23,16.53 v49.42,16.72
  Bottom 0.305: C15.1 | 54.01,17.58 54.71,16.88 U$1.2
  Bottom 0.61: C15.1 51.73,17.09 52.22,17.58 54.01,17.58
  Bottom 0.813: v49.42,16.72 50.95,16.72 C15.1
N$8  (via drill 0.36)
  Top 0.61: v56.5,9.25 56.5,11.43 55.95,11.97 v53.23,11.97
  Bottom 0.305: U$1.13 56.09,9.66 v56.5,9.25 | 51.77,11.97 C13.2
  Bottom 0.61: v53.23,11.97 51.77,11.97
N$9  (via drill 0.36)
  Top 0.61: v57.35,8.63 57.35,13.76 56.73,14.39 v53,14.39
  Bottom 0.305: U$1.12 56.74,9.94 57.35,9.33 v57.35,8.63 | 51.88,14.39 C15.2
  Bottom 0.61: v53,14.39 51.88,14.39
N$11  (via drill 0.36)
  Top 0.254: v56.26,17.34 56.26,18.45 C6.1 58.48,18.7 R13.2
  Bottom 0.406: U$1.5 56.74,16.87 v56.26,17.34
N$13
  Bottom 0.254: U$1.11 57.39,9.99 57.82,9.56 58.44,9.56 58.67,9.8 58.67,10.64 | 58.67,10.64 U$1.9 | 58.67,10.64 59.98,10.64 C10.1
N$15
  Bottom 0.254: C11.1 59.29,18.28 57.43,18.28 57.27,18.12 57.27,16.32 U$1.6
N$16  (via drill 0.36)
  Top 0.254: v60.07,21.31 60.46,21.31 60.7,21.08 60.7,20.02 R14.2
  Bottom 0.254: C11.2 59.32,21.02 59.69,21.31 v60.07,21.31
N$17  (via drill 0.36)
  Top 0.254: R15.2 58.67,16.02 58.67,16.72 v57.97,17.42
  Top 0.813: R12.1 58.67,15.97 R15.2
  Bottom 0.254: U$1.7 57.97,16.27 v57.97,17.42
N$21
  Top 0.406: R3.2 12.99,23.74 12.31,24.42 U$5.A1
  Bottom 0.254: U$1.4 56.09,15.61 55.72,15.24 53.93,15.24 53.7,14.93 53.7,13.92 52.84,13.06 48.48,13.06 48.48,7.23 46.38,5.13 40.47,5.13 40.08,5.52 37.2,5.52 36.82,5.13 20.79,5.13 17.68,8.24 11.85,8.24 9.9,10.19 9.9,22.55 10.99,23.64 11.58,23.64 R2.1
  Bottom 0.406: R2.1 11.61,26.13 U$5.A1
N$33  (via drill 0.36)
  Top 0.406: v52.37,22.79 51.28,22.79 50%.C
  Bottom 0.406: R22.1 52.34,22.75 v52.37,22.79
N$34  (via drill 0.36)
  Top 0.406: v52.37,24.65 75%.C
  Bottom 0.406: R21.1 v52.37,24.66 v52.37,24.65
N$35  (via drill 0.36)
  Top 0.406: v52.45,26.68 51.29,26.68 100%.C
  Bottom 0.406: R24.1 52.26,26.64 v52.45,26.68
RST  (via drill 0.36)
  Top 0.254: U5.22 33.08,7.23 34.4,5.91 34.4,4.82 36.12,3.11 43.04,3.11 43.51,3.57 U$2.RST
  Top 0.305: 33.08,7.23 32.38,7.93 v30.75,7.93
  Bottom 0.305: C1.1 32.9,6.88 R4.1 31.25,6.88 30.75,7.39 v30.75,7.93
RX0BF
  Top 0.254: IC1.12 26.7,26.08 26.7,25.43 23.51,22.24 23.51,19.68 25.93,17.26 30.44,17.26 U5.9
RX1BF
  Top 0.254: IC1.11 27.4,26.3 27.4,25.43 23.98,22.01 23.98,19.99 26.08,17.89 30.72,17.89 U5.8
RX_CAN  (via drill 0.36)
  Top 0.254: IC1.2 25.74,20.61 v25.74,20.18
  Bottom 0.254: v25.74,20.18 25.74,21.06 25.14,21.66 U6.4
RXINT
  Top 0.254: IC1.13 25.93,25.94 25.93,25.28 23.05,22.4 23.05,19.36 25.69,16.72 30.05,16.72 U5.10
SCL  (via drill 0.36)
  Top 0.254: U1.12 18.07,13.68 v18.38,13.37 19.4,13.37 R9.2 | U5.31 36.48,12.13 35.42,12.13 | 35.42,12.13 32.38,9.1 23.83,9.1 23.2,9.64 v23.2,13.14 | U$4.2 39.74,17.11 38.6,17.11 35.42,13.92 35.42,12.13
  Bottom 0.254: v23.2,13.14 22.97,13.37 v18.38,13.37
SDA  (via drill 0.36)
  Top 0.254: 16.46,14.31 U1.13 18.42,14.34 v18.46,14.39 | R8.2 18.03,17.77 16.94,17.77 v16.51,17.34 | v22.43,14.39 22.43,12.83 22.74,12.52 22.74,9.17 23.28,8.63 32.62,8.63 35.65,11.66 36.04,11.66 U5.30 38.06,9.65 v38.06,9.1
  Bottom 0.254: v22.43,14.39 v18.46,14.39 16.51,16.33 v16.51,17.34 | v38.06,9.1 38.22,8.86 38.45,8.86 42.03,12.44 U$4.1
SMBALERT  (via drill 0.36)
  Top 0.254: U1.16 19.58,16.3 v20.79,15.09 | v25.46,14.23 25.46,13.95 U5.18
  Bottom 0.254: v20.79,15.09 23.98,15.09 24.84,14.23 v25.46,14.23
STE  (via drill 0.36)
  Top 0.254: IC1.18 22.43,24.84 22.43,24.34 21.1,23.02 21.1,18.04 20.79,17.73 v20.79,17.5
  Top 0.305: U5.36 37.98,15.22 v37.98,15.4
  Bottom 0.254: 30.59,16.25 22.04,16.25 v20.79,17.5
  Bottom 0.305: v37.98,15.4 36.89,16.49 36.5,16.49 34.48,14.46 32.38,14.46 30.59,16.25
TEST  (via drill 0.36)
  Top 0.254: U5.21 32.66,6.8 33.63,5.83 33.63,4.12 v33.86,3.88
  Bottom 0.254: U$2.TST 42.26,4.12 42.26,3.57 42.03,3.34 34.4,3.34 v33.86,3.88
TRIGGER_CONVERT  (via drill 0.36)
  Top 0.254: 10.83,14.93 10.79,14.98 U1.3 9.48,14.98 9.2,14.7 9.2,10.11 11.07,8.24 12,8.24 15.58,4.66 27.4,4.66 v28.57,5.83 | v40.32,12.36 40.08,12.6 39.69,12.6 39.06,13.23 U5.35
  Bottom 0.254: v28.57,5.83 28.8,5.6 33.47,5.6 40.08,12.21 v40.32,12.36
TX0RTS  (via drill 0.36)
  Top 0.254: IC1.4 27.11,21.08 v27.4,21.08 | U5.7 31.19,18.35 28.41,18.35 v28.18,18.59
  Bottom 0.254: v27.4,21.08 28.18,20.3 v28.18,18.59
TX1RTS  (via drill 0.36)
  Top 0.254: IC1.5 27.33,21.78 v28.03,21.78 | v31.92,18.74 32.08,18.35 U5.6
  Bottom 0.254: v28.03,21.78 28.65,21.15 28.65,19.29 29.43,18.51 30.98,18.51 31.22,18.74 v31.92,18.74
TX2RTS  (via drill 0.36)
  Top 0.254: IC1.7 28.31,22.63 v28.73,22.63 | 33.41,17.95 U5.5 32.77,18.6 v32.77,19.44
  Bottom 0.254: v28.73,22.63 29.19,22.16 29.19,19.44 29.66,18.98 30.59,18.98 31.06,19.44 v32.77,19.44
TX_CAN  (via drill 0.36)
  Top 0.254: IC1.1 24.84,20.59 24.84,19.91 25.3,19.44 29.81,19.44 v30.05,19.68
  Bottom 0.254: U6.1 28.04,24.4 30.05,22.4 v30.05,19.68
UART_RX  (via drill 0.36)
  Top 0.254: U5.24 35.73,6.45 35.73,5.6 36.19,5.13 40.08,5.13 v40.86,5.91 | v45.45,5.91 45.61,5.91 45.99,5.52 45.99,4.2 U$2.RX
  Bottom 0.254: v40.86,5.91 v45.45,5.91
UART_TX
  Top 0.254: U5.23 35.18,6.06 35.18,5.05 36.12,4.12 39.66,4.12 U$2.TX
VBUS_BYPASS
  Top 0.254: U5.11 31.84,14 34.17,14 40.78,20.61 40.78,23.23 U$4.4
VBUS_ENABLE
  Top 0.254: U5.12 31.49,13.45 34.33,13.45 42.03,21.15 U$4.3
VCC  (via drill 0.36)
  Top 0.254: 5.39,10.96 5.39,9.32 R1.2 | U1.2 11.62,15.64 11.92,15.94 11.92,18.82 U$5.A2
  Top 0.406: U1.2 8.81,15.63 5.39,12.21 5.39,10.96
  Bottom 0.254: R2.2 11.82,21.67 | 10.6,19.6 10.6,19.52 11.07,19.05 U$5.A2
  Bottom 0.305: U$1.10 58.04,11.44 57.9,11.59 55.64,11.59 55.41,11.35 55.41,10.69 U$1.14
  Bottom 0.406: 10.6,19.6 10.6,20.66 R2.2
  other vias: 55.41,9.25 56.03,6.61 3.13,10.34 4.22,10.34 5.39,10.34 6.56,10.34 7.8,10.34 1.34,1.24 6.24,1.16 10.45,1.16 14.72,1.16 18.92,1.16 24.45,1.16 30.2,1.16 36.58,1.08 42.42,1.08 49.11,1.01 55.72,1.16 21.57,2.72 27.64,2.64 33.78,2.72 46.07,2.8 52.53,2.8 12.7,2.8 16.98,2.8 11.69,7.31 1.03,7.7
  pour Top (no thermals): 54.63,11.12 54.55,0.54 56.26,0.54 56.34,9.33 55.64,10.03 55.64,11.12
  pour Top (no thermals): 2.43,10.96 2.43,9.12 arc-90 1.16,7.85 arc90 0.33,7.02 0.18,0 10.52,0 56.34,0.07 56.26,3.26 12.23,3.19 12.31,7.77 9.5,7.85 arc-92 8.23,9.16 8.27,10.96
  pour Bottom (no thermals): 2.43,10.96 2.43,9.12 arc-90 1.16,7.85 arc90 0.33,7.02 0.33,4.22 arc90 1.6,2.95 10.65,2.95 arc90 11.92,4.22 11.92,6.58 arc90 10.65,7.85 9.5,7.85 arc-92 8.23,9.16 8.27,10.96
  pour Bottom: 0.18,8.09 12.31,7.85 12.23,3.34 55.1,3.26 56.26,3.26 56.26,0.07 51.59,0 0.26,0
  pour Bottom (no thermals): 55.02,11.12 55.02,9.72 54.32,9.02 54.32,0.54 55.48,0.54 56.34,0.54 56.34,11.2 55.02,11.2
  pour Top (no thermals): 55.02,11.12 55.02,9.72 54.32,9.02 54.32,0.54 55.48,0.54 56.34,0.54 56.34,11.2 55.02,11.2
VCC_1  (via drill 0.36)
  Top 0.254: 5.23,19.22 R1.1 | U1.1 9.31,16.3 8.89,16.72 8.89,18.28 8.97,18.35
  other vias: 1.11,18.51 8.89,18.35 8.81,25.51 0.96,25.43
  pour Top (no thermals): 9.12,25.82 0.02,25.82 0.02,17.89 9.05,17.89
  pour Bottom (no thermals): 9.12,25.82 0.02,25.82 0.02,17.89 9.05,17.89
VCORE
  Top 0.254: U5.32 37.68,11.78 C2.1
XIN
  Top 0.254: IC1.9 28.43,24.33 28.96,23.8 29.5,23.8 30.51,24.81 30.51,26.6 30.85,26.93 Q2.2 C7.1
XOUT
  Top 0.254: IC1.8 28.53,23.33 29.04,23.33 30.51,21.86 Q2.1 31.8,21.93 C8.1